# EAGLE schematic power source (EAGLE 5.11)
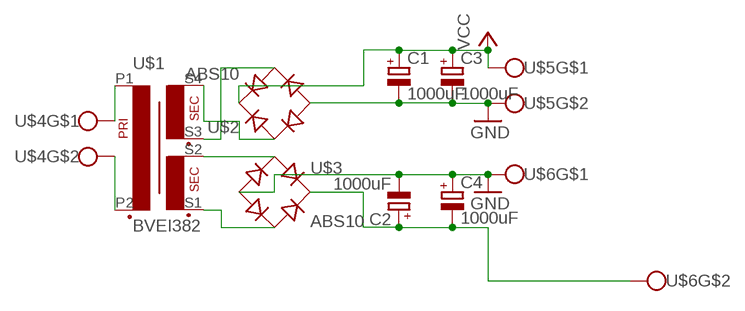
[diagram p0: schematic, sheet 1]

## Parts
C1  1000uF  CPOL-EUE5-13  [E5-13]
C2  1000uF  CPOL-EUE5-13  [E5-13]
C3  1000uF  CPOL-EUE5-13  [E5-13]
C4  1000uF  CPOL-EUE5-13  [E5-13]
U$1  BVEI382  [BVEI382]
U$2  ABS10  [SOIC-4]
U$3  ABS10  [SOIC-4]
U$4  110/2  [110/2]
U$5  110/2  [110/2]
U$6  110/2  [110/2]

## Nets
GND: C1.- C2.- C3.- C4.+ U$2.- U$3.- U$5.P$2 U$6.P$1
N$1: U$1.S3 U$2.~2(AC2)
N$2: U$1.S4 U$2.~1(AC1)
N$3: U$1.S2 U$3.~1(AC1)
N$4: U$1.S1 U$3.~2(AC2)
N$5: U$1.P1 U$4.P$1
N$6: U$1.P2 U$4.P$2
N$7: C2.+ C4.- U$3.+ U$6.P$2
VCC: C1.+ C3.+ U$2.+ U$5.P$1

## Library data of the parts
C1-C4 = resistor:CPOL-EU: POLARIZED CAPACITOR, European symbol
U$1 = trafo2-2:BVEI382
U$2 U$3 = rectifier:ABS10
U$4-U$6 = con-wago-500:110/2